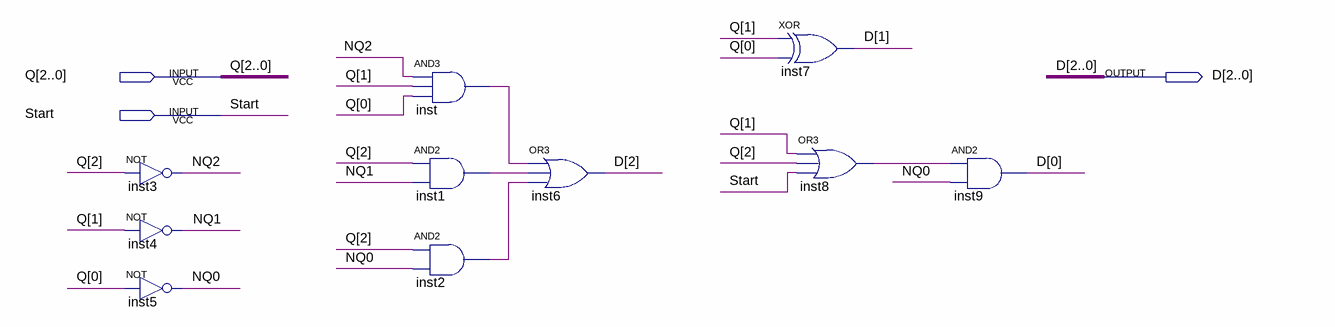
[diagram p0: schematic sheet]
// Quartus schematic NextState.bdf as structural Verilog: 10 symbols, 3 pins
module NextState (
  input  [2:0] Q,
  input  Start,
  output [2:0] D
);

  wire inst1_out, inst2_out, inst8_out, inst_out, NQ0, NQ1, NQ2;

  not inst3 (NQ2, Q[2]);
  not inst4 (NQ1, Q[1]);
  not inst5 (NQ0, Q[0]);
  and inst (inst_out, NQ2, Q[1], Q[0]);
  and inst1 (inst1_out, Q[2], NQ1);
  and inst2 (inst2_out, Q[2], NQ0);
  or inst6 (D[2], inst_out, inst1_out, inst2_out);
  xor inst7 (D[1], Q[1], Q[0]);
  or inst8 (inst8_out, Q[1], Q[2], Start);
  and inst9 (D[0], inst8_out, NQ0);
endmodule
